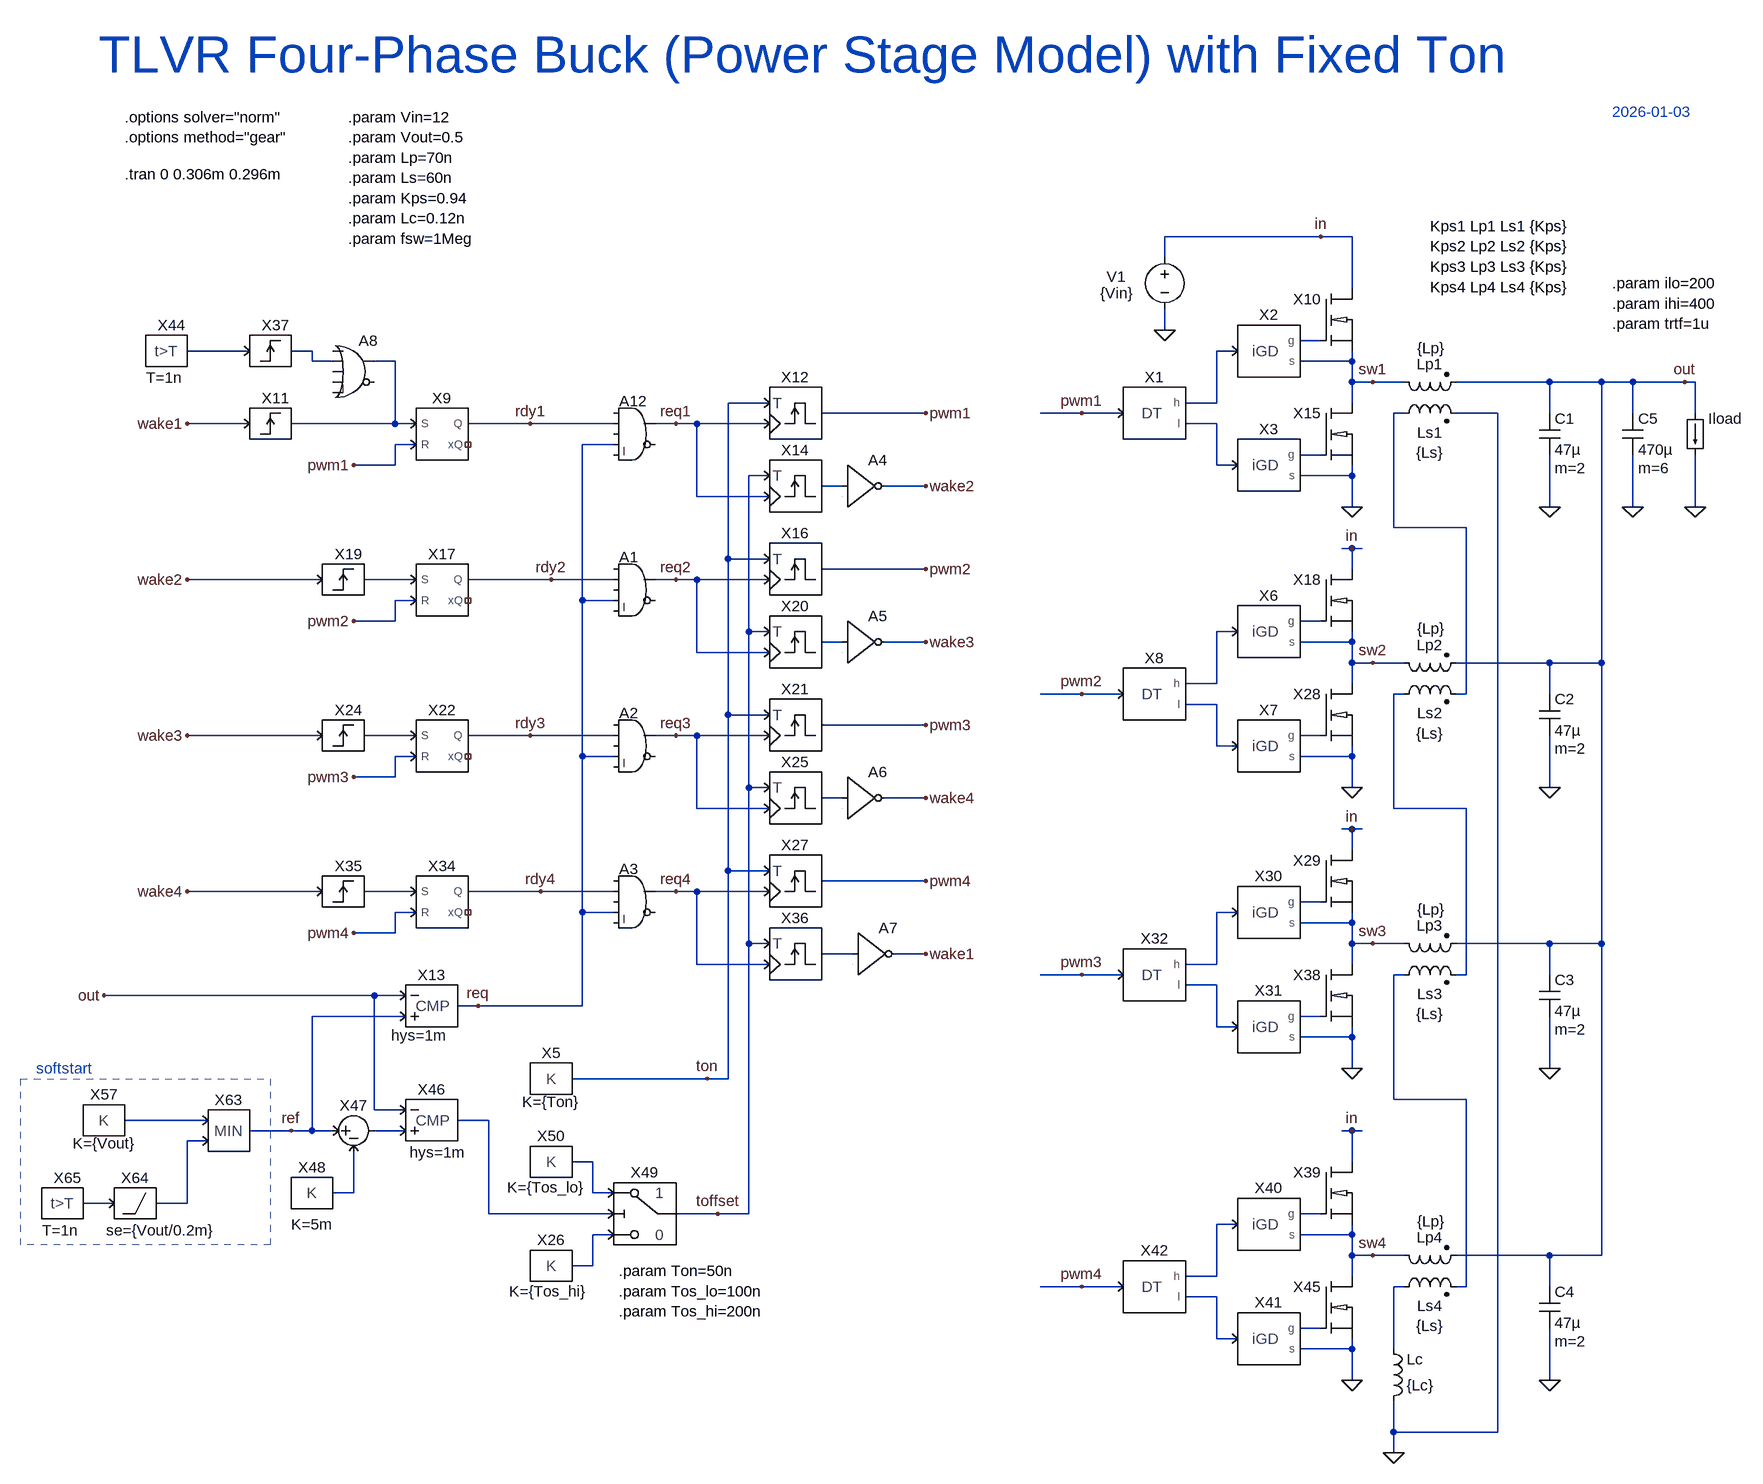
[diagram p0: schematic TLVR_4phBUCK_powerstage.asc]
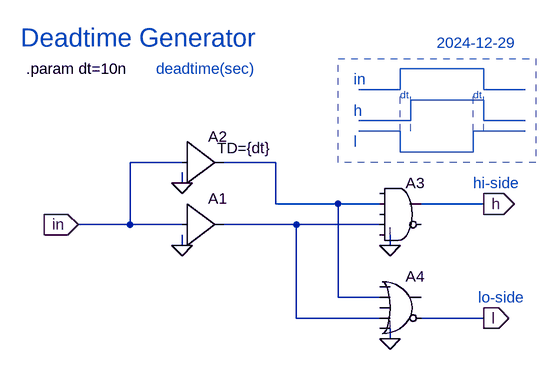
[diagram p1: sub-circuit deadtime.asc]
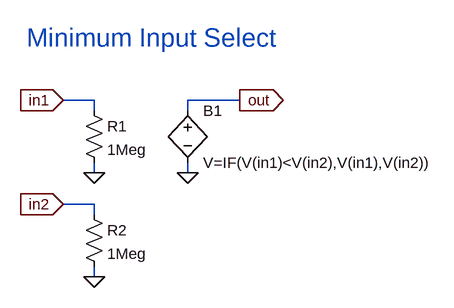
[diagram p2: sub-circuit min.asc]
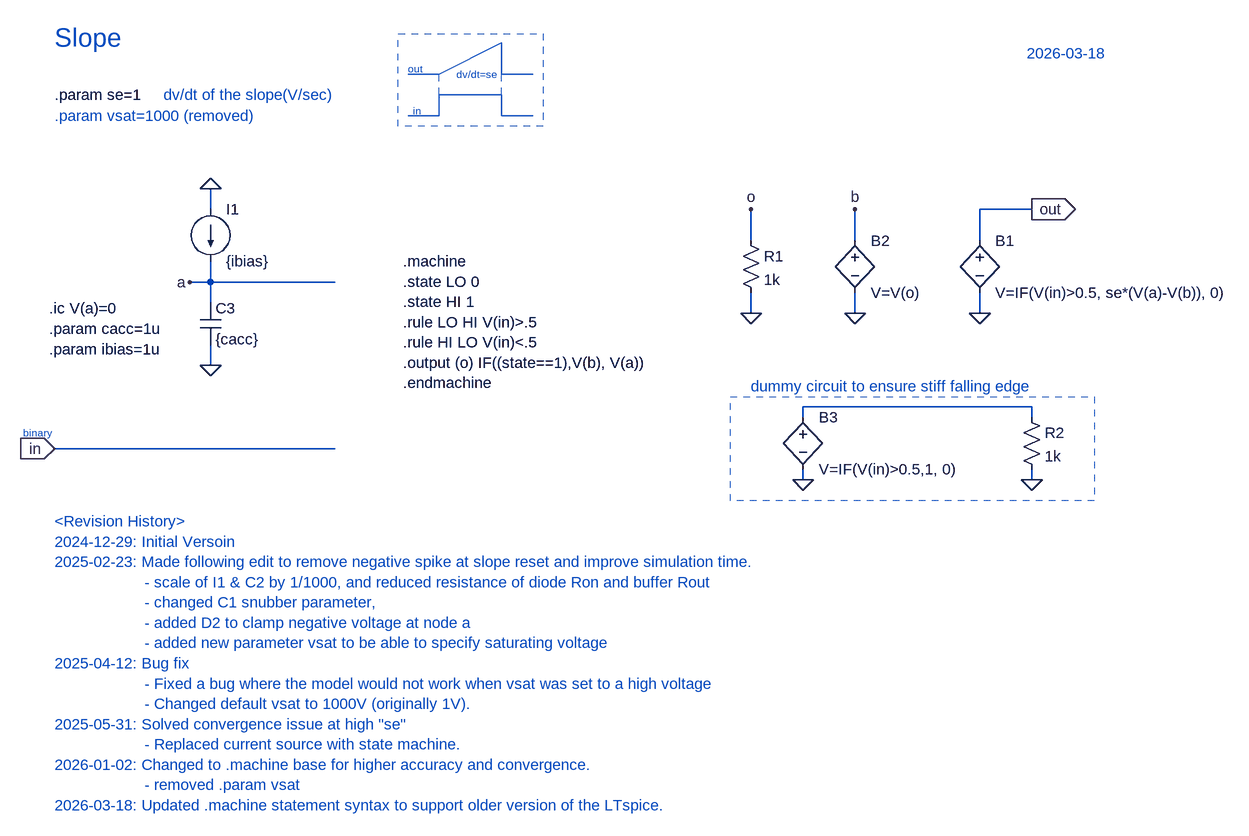
[diagram p3: sub-circuit slope.asc]
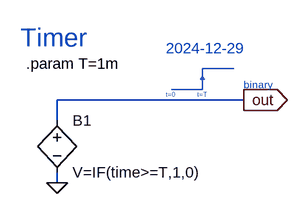
[diagram p4: sub-circuit timer.asc]
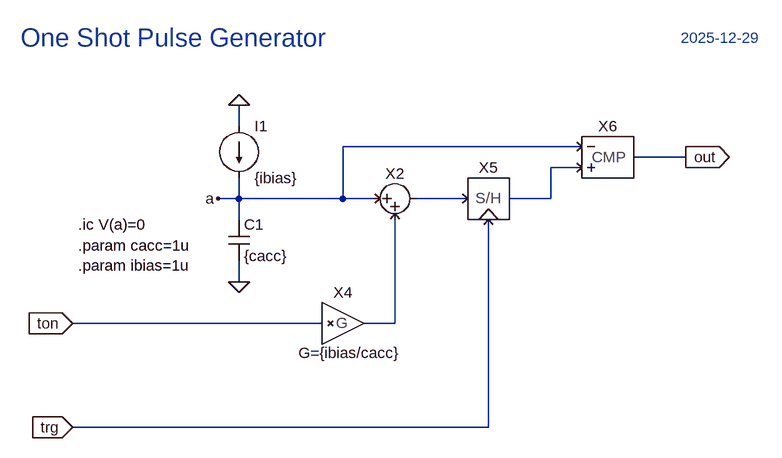
[diagram p5: sub-circuit oneshot.asc]
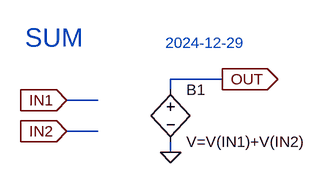
[diagram p6: sub-circuit sum.asc]
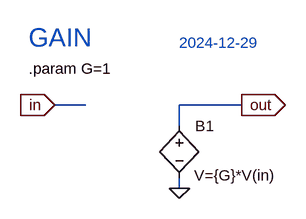
[diagram p7: sub-circuit gain.asc]
TLVR_4phBUCK_powerstage.asc, the LTspice schematic file:
Version 4.1
SHEET 1 3372 4420
WIRE 1088 320 848 320
WIRE 1136 320 1088 320
WIRE 848 352 848 320
WIRE 1136 400 1136 320
WIRE 848 464 848 432
WIRE 1088 480 1056 480
WIRE -560 496 -656 496
WIRE -464 496 -496 496
WIRE 960 496 928 496
WIRE -464 512 -464 496
WIRE -432 512 -464 512
WIRE -336 512 -368 512
WIRE 1136 512 1136 496
WIRE 1136 512 1056 512
WIRE 1136 544 1136 512
WIRE 1168 544 1136 544
WIRE 1216 544 1168 544
WIRE 1440 544 1296 544
WIRE 1520 544 1440 544
WIRE 1568 544 1520 544
WIRE 1648 544 1568 544
WIRE 1664 544 1648 544
WIRE 240 576 176 576
WIRE 928 576 928 496
WIRE 928 576 880 576
WIRE 1136 576 1136 544
WIRE 480 592 320 592
WIRE 720 592 656 592
WIRE 784 592 720 592
WIRE 1216 592 1200 592
WIRE 1360 592 1296 592
WIRE 1440 592 1440 544
WIRE 1568 592 1568 544
WIRE 1664 592 1664 544
WIRE -560 608 -656 608
WIRE -336 608 -336 512
WIRE -336 608 -496 608
WIRE -304 608 -336 608
WIRE -128 608 -224 608
WIRE 0 608 -128 608
WIRE 96 608 64 608
WIRE 128 608 96 608
WIRE 240 608 128 608
WIRE 928 608 880 608
WIRE -304 640 -336 640
WIRE 0 640 -48 640
WIRE 1088 656 1056 656
WIRE -336 672 -336 640
WIRE -336 672 -400 672
WIRE 928 672 928 608
WIRE 960 672 928 672
WIRE 240 688 208 688
WIRE 1136 688 1136 672
WIRE 1136 688 1056 688
WIRE 352 704 320 704
WIRE 480 704 416 704
WIRE 128 720 128 608
WIRE 240 720 128 720
WIRE 1136 736 1136 688
WIRE 1440 736 1440 656
WIRE 1568 736 1568 656
WIRE 1664 736 1664 656
WIRE 1200 768 1200 592
WIRE 1312 768 1200 768
WIRE 1136 800 1120 800
WIRE 1152 800 1136 800
WIRE 176 816 176 576
WIRE 240 816 176 816
WIRE 480 832 320 832
WIRE 1136 832 1136 800
WIRE -448 848 -656 848
WIRE -304 848 -384 848
WIRE -96 848 -224 848
WIRE 0 848 -96 848
WIRE 96 848 64 848
WIRE 128 848 96 848
WIRE 240 848 128 848
WIRE -304 880 -336 880
WIRE -48 880 -48 640
WIRE 0 880 -48 880
WIRE -336 912 -336 880
WIRE -336 912 -400 912
WIRE 1088 912 1056 912
WIRE 208 928 208 688
WIRE 240 928 208 928
WIRE 960 928 928 928
WIRE 352 944 320 944
WIRE 480 944 416 944
WIRE 1136 944 1136 928
WIRE 1136 944 1056 944
WIRE 128 960 128 848
WIRE 240 960 128 960
WIRE 1136 976 1136 944
WIRE 1168 976 1136 976
WIRE 1216 976 1168 976
WIRE 1440 976 1296 976
WIRE 1520 976 1520 544
WIRE 1520 976 1440 976
WIRE 928 1008 928 928
WIRE 928 1008 880 1008
WIRE 1136 1008 1136 976
WIRE 720 1024 656 1024
WIRE 784 1024 720 1024
WIRE 1216 1024 1200 1024
WIRE 1312 1024 1312 768
WIRE 1312 1024 1296 1024
WIRE 1440 1024 1440 976
WIRE 928 1040 880 1040
WIRE 176 1056 176 816
WIRE 240 1056 176 1056
WIRE 480 1072 320 1072
WIRE -448 1088 -656 1088
WIRE -304 1088 -384 1088
WIRE -128 1088 -224 1088
WIRE 0 1088 -128 1088
WIRE 96 1088 64 1088
WIRE 128 1088 96 1088
WIRE 240 1088 128 1088
WIRE 1088 1088 1056 1088
WIRE 928 1104 928 1040
WIRE 960 1104 928 1104
WIRE -304 1120 -336 1120
WIRE -48 1120 -48 880
WIRE 0 1120 -48 1120
WIRE 1136 1120 1136 1104
WIRE 1136 1120 1056 1120
WIRE -336 1152 -336 1120
WIRE -336 1152 -400 1152
WIRE 208 1168 208 928
WIRE 240 1168 208 1168
WIRE 1136 1168 1136 1120
WIRE 1440 1168 1440 1088
WIRE 352 1184 320 1184
WIRE 480 1184 416 1184
WIRE 128 1200 128 1088
WIRE 240 1200 128 1200
WIRE 1200 1200 1200 1024
WIRE 1312 1200 1200 1200
WIRE 1136 1232 1120 1232
WIRE 1152 1232 1136 1232
WIRE 1136 1264 1136 1232
WIRE 176 1296 176 1056
WIRE 240 1296 176 1296
WIRE 480 1312 320 1312
WIRE -448 1328 -656 1328
WIRE -304 1328 -384 1328
WIRE -112 1328 -224 1328
WIRE 0 1328 -112 1328
WIRE 96 1328 64 1328
WIRE 128 1328 96 1328
WIRE 240 1328 128 1328
WIRE 1088 1344 1056 1344
WIRE -304 1360 -336 1360
WIRE -48 1360 -48 1120
WIRE 0 1360 -48 1360
WIRE 960 1360 928 1360
WIRE 1136 1376 1136 1360
WIRE 1136 1376 1056 1376
WIRE -336 1392 -336 1360
WIRE -336 1392 -400 1392
WIRE 208 1408 208 1168
WIRE 240 1408 208 1408
WIRE 1136 1408 1136 1376
WIRE 1168 1408 1136 1408
WIRE 1216 1408 1168 1408
WIRE 1440 1408 1296 1408
WIRE 1520 1408 1520 976
WIRE 1520 1408 1440 1408
WIRE 368 1424 320 1424
WIRE 480 1424 432 1424
WIRE 128 1440 128 1328
WIRE 240 1440 128 1440
WIRE 928 1440 928 1360
WIRE 928 1440 880 1440
WIRE 1136 1440 1136 1408
WIRE 720 1456 656 1456
WIRE 784 1456 720 1456
WIRE 1216 1456 1200 1456
WIRE 1312 1456 1312 1200
WIRE 1312 1456 1296 1456
WIRE 1440 1456 1440 1408
WIRE 928 1472 880 1472
WIRE -368 1488 -784 1488
WIRE -320 1488 -368 1488
WIRE -208 1504 -240 1504
WIRE -48 1504 -48 1360
WIRE -48 1504 -208 1504
WIRE -320 1520 -464 1520
WIRE 1088 1520 1056 1520
WIRE 928 1536 928 1472
WIRE 960 1536 928 1536
WIRE 1136 1552 1136 1536
WIRE 1136 1552 1056 1552
WIRE 1136 1600 1136 1552
WIRE 1440 1600 1440 1520
WIRE 144 1616 -64 1616
WIRE 176 1616 176 1296
WIRE 176 1616 144 1616
WIRE 1200 1648 1200 1456
WIRE 1312 1648 1200 1648
WIRE -368 1664 -368 1488
WIRE -320 1664 -368 1664
WIRE -624 1680 -752 1680
WIRE -192 1680 -240 1680
WIRE -496 1696 -560 1696
WIRE -464 1696 -464 1520
WIRE -464 1696 -496 1696
WIRE -432 1696 -464 1696
WIRE -320 1696 -368 1696
WIRE 1136 1696 1120 1696
WIRE 1152 1696 1136 1696
WIRE -624 1712 -656 1712
WIRE -32 1744 -64 1744
WIRE 1136 1744 1136 1696
WIRE -400 1792 -400 1728
WIRE -400 1792 -432 1792
WIRE -32 1792 -32 1744
WIRE 0 1792 -32 1792
WIRE -768 1808 -816 1808
WIRE -656 1808 -656 1712
WIRE -656 1808 -704 1808
WIRE -192 1824 -192 1680
WIRE 0 1824 -192 1824
WIRE 160 1824 96 1824
WIRE 208 1824 208 1408
WIRE 208 1824 160 1824
WIRE 1088 1824 1056 1824
WIRE 960 1840 928 1840
WIRE 0 1856 -32 1856
WIRE 1136 1856 1136 1840
WIRE 1136 1856 1056 1856
WIRE 1136 1888 1136 1856
WIRE 1168 1888 1136 1888
WIRE 1216 1888 1168 1888
WIRE 1440 1888 1296 1888
WIRE 1520 1888 1520 1408
WIRE 1520 1888 1440 1888
WIRE -32 1904 -32 1856
WIRE -32 1904 -64 1904
WIRE 928 1920 928 1840
WIRE 928 1920 880 1920
WIRE 1136 1920 1136 1888
WIRE 720 1936 656 1936
WIRE 784 1936 720 1936
WIRE 1216 1936 1200 1936
WIRE 1312 1936 1312 1648
WIRE 1312 1936 1296 1936
WIRE 1440 1936 1440 1888
WIRE 928 1952 880 1952
WIRE 1088 2000 1056 2000
WIRE 928 2016 928 1952
WIRE 960 2016 928 2016
WIRE 1136 2032 1136 2016
WIRE 1136 2032 1056 2032
WIRE 1200 2032 1200 1936
WIRE 1136 2080 1136 2032
WIRE 1440 2080 1440 2000
WIRE 1200 2160 1200 2112
WIRE 1360 2160 1360 592
WIRE 1360 2160 1200 2160
WIRE 1200 2192 1200 2160
FLAG 1136 736 0
FLAG 848 464 0
FLAG 1440 736 0
FLAG 1648 544 out
FLAG 1088 320 in
FLAG 1168 544 sw1
FLAG 1664 736 0
FLAG 720 592 pwm1
FLAG 1136 1168 0
FLAG 1440 1168 0
FLAG 1136 800 in
FLAG 1168 976 sw2
FLAG 720 1024 pwm2
FLAG 1136 1600 0
FLAG 1440 1600 0
FLAG 1136 1232 in
FLAG 1168 1408 sw3
FLAG 720 1456 pwm3
FLAG 1136 2080 0
FLAG 1440 2080 0
FLAG 1136 1696 in
FLAG 1168 1888 sw4
FLAG 720 1936 pwm4
FLAG 1200 2192 0
FLAG -784 1488 out
FLAG -496 1696 ref
FLAG 480 592 pwm1
FLAG 96 608 req1
FLAG -208 1504 req
FLAG -128 608 rdy1
FLAG -400 672 pwm1
FLAG 160 1824 toffset
FLAG 480 704 wake2
FLAG 480 832 pwm2
FLAG 96 848 req2
FLAG -96 848 rdy2
FLAG -400 912 pwm2
FLAG 480 944 wake3
FLAG 480 1072 pwm3
FLAG 96 1088 req3
FLAG -128 1088 rdy3
FLAG 480 1184 wake4
FLAG 480 1312 pwm4
FLAG 96 1328 req4
FLAG -112 1328 rdy4
FLAG -400 1392 pwm4
FLAG 480 1424 wake1
FLAG -400 1152 pwm3
FLAG -656 608 wake1
FLAG -656 848 wake2
FLAG -656 1088 wake3
FLAG -656 1328 wake4
FLAG 144 1616 ton
FLAG 1568 736 0
SYMBOL voltage 848 336 R0
WINDOW 0 -75 30 Top 2
WINDOW 3 -74 87 Bottom 2
WINDOW 123 0 0 Left 0
WINDOW 39 0 0 Left 0
SYMATTR InstName V1
SYMATTR Value {Vin}
SYMBOL cap 1424 592 R0
WINDOW 123 24 84 Left 2
SYMATTR Value2 m=2
SYMATTR InstName C1
SYMATTR Value 47µ
SYMATTR SpiceLine Rser=0.1m
SYMBOL iGD 1008 496 R0
SYMATTR InstName X2
SYMBOL iGD 1008 672 R0
SYMATTR InstName X3
SYMBOL DEADTIME 832 592 R0
SYMATTR InstName X1
SYMBOL iNMOS 1136 448 R0
SYMATTR SpiceLine ron=0.1m
SYMATTR InstName X10
SYMBOL iGD 1008 928 R0
SYMATTR InstName X6
SYMBOL iGD 1008 1104 R0
SYMATTR InstName X7
SYMBOL DEADTIME 832 1024 R0
SYMATTR InstName X8
SYMBOL iGD 1008 1360 R0
SYMATTR InstName X30
SYMBOL iGD 1008 1536 R0
SYMATTR InstName X31
SYMBOL DEADTIME 832 1456 R0
SYMATTR InstName X32
SYMBOL iGD 1008 1840 R0
SYMATTR InstName X40
SYMBOL iGD 1008 2016 R0
SYMATTR InstName X41
SYMBOL DEADTIME 832 1936 R0
SYMATTR InstName X42
SYMBOL ind2 1200 528 M90
WINDOW 0 4 56 VBottom 2
WINDOW 3 -52 58 VTop 2
SYMATTR InstName Lp1
SYMATTR Value {Lp}
SYMATTR SpiceLine Rser=0.125m
SYMBOL ind2 1200 608 R270
WINDOW 0 -29 56 VTop 2
WINDOW 3 -29 56 VBottom 2
SYMATTR InstName Ls1
SYMATTR Value {Ls}
SYMATTR SpiceLine Rser=0.45m
SYMBOL ind2 1200 960 M90
WINDOW 0 4 56 VBottom 2
WINDOW 3 -52 58 VTop 2
SYMATTR InstName Lp2
SYMATTR Value {Lp}
SYMATTR SpiceLine Rser=0.125m
SYMBOL ind2 1200 1040 R270
WINDOW 0 -29 56 VTop 2
WINDOW 3 -29 56 VBottom 2
SYMATTR InstName Ls2
SYMATTR Value {Ls}
SYMATTR SpiceLine Rser=0.45m
SYMBOL ind2 1200 1392 M90
WINDOW 0 4 56 VBottom 2
WINDOW 3 -52 58 VTop 2
SYMATTR InstName Lp3
SYMATTR Value {Lp}
SYMATTR SpiceLine Rser=0.125m
SYMBOL ind2 1200 1472 R270
WINDOW 0 -29 56 VTop 2
WINDOW 3 -29 56 VBottom 2
SYMATTR InstName Ls3
SYMATTR Value {Ls}
SYMATTR SpiceLine Rser=0.45m
SYMBOL ind2 1200 1872 M90
WINDOW 0 4 56 VBottom 2
WINDOW 3 -52 58 VTop 2
SYMATTR InstName Lp4
SYMATTR Value {Lp}
SYMATTR SpiceLine Rser=0.125m
SYMBOL ind2 1200 1952 R270
WINDOW 0 -29 56 VTop 2
WINDOW 3 -29 56 VBottom 2
SYMATTR InstName Ls4
SYMATTR Value {Ls}
SYMATTR SpiceLine Rser=0.45m
SYMBOL ind 1184 2128 M180
WINDOW 0 36 80 Left 2
WINDOW 3 36 40 Left 2
SYMATTR InstName Lc
SYMATTR Value {Lc}
SYMATTR SpiceLine Rser=2m
SYMBOL cap 1424 1024 R0
WINDOW 123 24 84 Left 2
SYMATTR Value2 m=2
SYMATTR InstName C2
SYMATTR Value 47µ
SYMATTR SpiceLine Rser=0.1m
SYMBOL cap 1424 1456 R0
WINDOW 123 24 84 Left 2
SYMATTR Value2 m=2
SYMATTR InstName C3
SYMATTR Value 47µ
SYMATTR SpiceLine Rser=0.1m
SYMBOL cap 1424 1936 R0
WINDOW 123 24 84 Left 2
SYMATTR Value2 m=2
SYMATTR InstName C4
SYMATTR Value 47µ
SYMATTR SpiceLine Rser=0.1m
SYMBOL CONST -784 1680 R0
WINDOW 39 0 51 Bottom 2
SYMATTR SpiceLine K={Vout}
SYMATTR InstName X57
SYMBOL PowerSim\\MIN -592 1696 R0
SYMATTR InstName X63
SYMBOL PowerSim\\SLOPE -736 1808 R0
WINDOW 39 39 57 Bottom 2
SYMATTR SpiceLine se={Vout/0.2m}
SYMATTR InstName X64
SYMBOL PowerSim\\TIMER -848 1808 R0
WINDOW 39 -3 57 Bottom 2
SYMATTR SpiceLine T=1n
SYMATTR InstName X65
SYMBOL PowerSim\\ONESHOT 288 592 R0
SYMATTR InstName X12
SYMBOL PowerSim\\CMP -272 1504 R0
WINDOW 39 -27 61 Bottom 2
SYMATTR SpiceLine hys=1m
SYMATTR InstName X13
SYMBOL Digital\\and 32 560 R0
WINDOW 0 -23 13 Left 2
SYMATTR InstName A12
SYMBOL PowerSim\\SRFF -272 624 R0
SYMATTR InstName X9
SYMBOL PowerSim\\POSEDGE -528 608 R0
SYMATTR InstName X11
SYMBOL PowerSim\\ONESHOT 288 704 R0
SYMATTR InstName X14
SYMBOL PowerSim\\ONESHOT 288 832 R0
SYMATTR InstName X16
SYMBOL Digital\\and 32 800 R0
WINDOW 0 -23 13 Left 2
SYMATTR InstName A1
SYMBOL PowerSim\\SRFF -272 864 R0
SYMATTR InstName X17
SYMBOL PowerSim\\POSEDGE -416 848 R0
SYMATTR InstName X19
SYMBOL PowerSim\\ONESHOT 288 944 R0
SYMATTR InstName X20
SYMBOL PowerSim\\ONESHOT 288 1072 R0
SYMATTR InstName X21
SYMBOL Digital\\and 32 1040 R0
WINDOW 0 -23 13 Left 2
SYMATTR InstName A2
SYMBOL PowerSim\\SRFF -272 1104 R0
SYMATTR InstName X22
SYMBOL PowerSim\\POSEDGE -416 1088 R0
SYMATTR InstName X24
SYMBOL PowerSim\\ONESHOT 288 1184 R0
SYMATTR InstName X25
SYMBOL CONST -96 1904 R0
WINDOW 39 -5 55 Bottom 2
SYMATTR SpiceLine K={Tos_hi}
SYMATTR InstName X26
SYMBOL PowerSim\\ONESHOT 288 1312 R0
SYMATTR InstName X27
SYMBOL Digital\\and 32 1280 R0
WINDOW 0 -23 13 Left 2
SYMATTR InstName A3
SYMBOL PowerSim\\SRFF -272 1344 R0
SYMATTR InstName X34
SYMBOL PowerSim\\POSEDGE -416 1328 R0
SYMATTR InstName X35
SYMBOL PowerSim\\ONESHOT 288 1424 R0
SYMATTR InstName X36
SYMBOL Digital\\inv 352 640 R0
SYMATTR InstName A4
SYMBOL Digital\\inv 352 880 R0
SYMATTR InstName A5
SYMBOL Digital\\inv 352 1120 R0
SYMATTR InstName A6
SYMBOL Digital\\inv 368 1360 R0
SYMATTR InstName A7
SYMBOL PowerSim\\POSEDGE -528 496 R0
SYMATTR InstName X37
SYMBOL Digital\\or -400 464 R0
SYMATTR InstName A8
SYMBOL PowerSim\\TIMER -688 496 R0
WINDOW 39 -3 57 Bottom 2
SYMATTR SpiceLine T=1n
SYMATTR InstName X44
SYMBOL CONST -96 1616 R0
WINDOW 39 0 51 Bottom 2
SYMATTR SpiceLine K={Ton}
SYMATTR InstName X5
SYMBOL iNMOS 1136 624 R0
SYMATTR SpiceLine ron=0.1m
SYMATTR InstName X15
SYMBOL iNMOS 1136 880 R0
SYMATTR SpiceLine ron=0.1m
SYMATTR InstName X18
SYMBOL iNMOS 1136 1056 R0
SYMATTR SpiceLine ron=0.1m
SYMATTR InstName X28
SYMBOL iNMOS 1136 1312 R0
SYMATTR SpiceLine ron=0.1m
SYMATTR InstName X29
SYMBOL iNMOS 1136 1488 R0
SYMATTR SpiceLine ron=0.1m
SYMATTR InstName X38
SYMBOL iNMOS 1136 1792 R0
SYMATTR SpiceLine ron=0.1m
SYMATTR InstName X39
SYMBOL iNMOS 1136 1968 R0
SYMATTR SpiceLine ron=0.1m
SYMATTR InstName X45
SYMBOL PowerSim\\CMP -272 1680 R0
WINDOW 39 1 65 Bottom 2
SYMATTR SpiceLine hys=1m
SYMATTR InstName X46
SYMBOL PowerSim\\SUB -400 1696 R0
SYMATTR InstName X47
SYMBOL PowerSim\\CONST -464 1792 R0
WINDOW 39 0 64 Bottom 2
SYMATTR SpiceLine K=5m
SYMATTR InstName X48
SYMBOL PowerSim\\MUX 48 1824 R0
SYMATTR InstName X49
SYMBOL CONST -96 1744 R0
WINDOW 39 -8 55 Bottom 2
SYMATTR SpiceLine K={Tos_lo}
SYMATTR InstName X50
SYMBOL load 1648 592 R0
WINDOW 3 48 56 Invisible 2
WINDOW 123 0 0 Left 0
WINDOW 39 48 36 Left 2
SYMATTR Value PWL(0 {ilo} 0.3m {ilo} +{trtf} {ihi} 0.6m {ihi} +{trtf} {ilo})
SYMATTR InstName Iload
SYMBOL cap 1552 592 R0
WINDOW 123 24 84 Left 2
SYMATTR Value2 m=6
SYMATTR InstName C5
SYMATTR Value 470µ
SYMATTR SpiceLine Rser=2m
TEXT -752 224 Left 2 !.tran 0 0.306m 0.296m
TEXT -792 40 Left 6 ;TLVR Four-Phase Buck (Power Stage Model) with Fixed Ton
TEXT 1536 128 Left 2 ;2026-01-03
TEXT -408 136 Left 2 !.param Vin=12\n.param Vout=0.5\n.param Lp=70n\n.param Ls=60n\n.param Kps=0.94\n.param Lc=0.12n\n.param fsw=1Meg
TEXT 1536 392 Left 2 !.param ilo=200\n.param ihi=400\n.param trtf=1u
TEXT -752 136 Left 2 !.options solver="norm"\n.options method="gear"
TEXT 1256 304 Left 2 !Kps1 Lp1 Ls1 {Kps}\nKps2 Lp2 Ls2 {Kps}\nKps3 Lp3 Ls3 {Kps}\nKps4 Lp4 Ls4 {Kps}
TEXT -888 1600 Left 2 ;softstart
TEXT 8 1912 Left 2 !.param Ton=50n\n.param Tos_lo=100n\n.param Tos_hi=200n
RECTANGLE Normal -528 1872 -912 1616 2

deadtime.asc, the sub-circuit schematic file:
Version 4
SHEET 1 1412 1312
WIRE 64 288 -16 288
WIRE 208 288 128 288
WIRE 64 320 64 304
WIRE 208 352 208 288
WIRE 304 352 208 352
WIRE 368 352 304 352
WIRE 528 352 432 352
WIRE -16 384 -16 288
WIRE -16 384 -96 384
WIRE 64 384 -16 384
WIRE 240 384 128 384
WIRE 368 384 240 384
WIRE 64 416 64 400
WIRE 384 416 384 400
WIRE 304 496 304 352
WIRE 368 496 304 496
WIRE 240 528 240 384
WIRE 368 528 240 528
WIRE 528 528 432 528
WIRE 384 560 384 544
FLAG -96 384 in
IOPIN -96 384 In
FLAG 64 416 0
FLAG 64 320 0
FLAG 384 416 0
FLAG 384 560 0
FLAG 528 352 h
IOPIN 528 352 Out
FLAG 528 528 l
IOPIN 528 528 Out
SYMBOL Digital\\buf1 64 320 R0
SYMATTR InstName A1
SYMBOL Digital\\buf1 64 224 R0
WINDOW 3 54 42 Left 2
SYMATTR Value TD={dt}
SYMATTR InstName A2
SYMBOL Digital\\and 400 304 R0
SYMATTR InstName A3
SYMBOL Digital\\or 400 448 R0
SYMATTR InstName A4
TEXT -176 144 Left 2 !.param dt=10n
TEXT -184 96 Left 4 ;Deadtime Generator
TEXT 24 144 Left 2 ;deadtime(sec)
TEXT 512 320 Left 2 ;hi-side
TEXT 520 496 Left 2 ;lo-side
TEXT 328 160 Left 2 ;in
TEXT 328 208 Left 2 ;h
TEXT 328 256 Left 2 ;l
TEXT 400 184 Left 1 ;dt
TEXT 512 184 Left 1 ;dt
TEXT 456 104 Left 2 ;2024-12-29
LINE Normal 400 176 336 176
LINE Normal 400 176 400 144
LINE Normal 528 144 400 144
LINE Normal 528 176 528 144
LINE Normal 592 176 528 176
LINE Normal 416 224 336 224
LINE Normal 416 224 416 192
LINE Normal 528 192 416 192
LINE Normal 528 224 528 192
LINE Normal 592 224 528 224
LINE Normal 400 240 336 240
LINE Normal 400 272 400 240
LINE Normal 512 272 400 272
LINE Normal 512 272 512 240
LINE Normal 592 240 512 240
LINE Normal 400 240 400 176 2
LINE Normal 512 240 512 176 2
LINE Normal 416 240 416 176 2
LINE Normal 528 240 528 176 2
RECTANGLE Normal 608 288 304 128 2

min.asc, the sub-circuit schematic file:
Version 4
SHEET 1 880 680
WIRE 112 64 64 64
WIRE 336 64 256 64
WIRE 112 80 112 64
WIRE 256 80 256 64
WIRE 112 176 112 160
WIRE 256 176 256 160
WIRE 112 224 64 224
WIRE 112 240 112 224
WIRE 112 336 112 320
FLAG 64 64 in1
IOPIN 64 64 In
FLAG 64 224 in2
IOPIN 64 224 In
FLAG 256 176 0
FLAG 336 64 out
IOPIN 336 64 Out
FLAG 112 176 0
FLAG 112 336 0
SYMBOL bv 256 64 R0
SYMATTR InstName B1
SYMATTR Value V=IF(V(in1)<V(in2),V(in1),V(in2))
SYMBOL res 96 64 R0
SYMATTR InstName R1
SYMATTR Value 1Meg
SYMBOL res 96 224 R0
SYMATTR InstName R2
SYMATTR Value 1Meg
TEXT 8 -32 Left 4 ;Minimum Input Select

slope.asc, the sub-circuit schematic file:
Version 4.1
SHEET 1 2080 1228
WIRE -64 288 -64 256
WIRE 1200 288 1120 288
WIRE 768 336 768 288
WIRE 928 336 928 288
WIRE 1120 336 1120 288
WIRE -64 400 -64 368
WIRE -64 400 -96 400
WIRE 128 400 -64 400
WIRE -64 432 -64 400
WIRE 768 448 768 416
WIRE 928 448 928 416
WIRE 1120 448 1120 416
WIRE -64 528 -64 496
WIRE 1200 592 848 592
WIRE 848 608 848 592
WIRE 1200 608 1200 592
WIRE 128 656 -304 656
WIRE 848 704 848 688
WIRE 1200 704 1200 688
FLAG -304 656 in
IOPIN -304 656 In
FLAG -64 256 0
FLAG -64 528 0
FLAG 1200 288 out
IOPIN 1200 288 Out
FLAG -96 400 a
FLAG 1120 448 0
FLAG 768 448 0
FLAG 768 288 o
FLAG 928 448 0
FLAG 928 288 b
FLAG 1200 704 0
FLAG 848 704 0
SYMBOL current -64 288 R0
SYMATTR InstName I1
SYMATTR Value {ibias}
SYMBOL cap -80 432 R0
SYMATTR InstName C3
SYMATTR Value {cacc}
SYMBOL bv 1120 320 R0
SYMATTR InstName B1
SYMATTR Value V=IF(V(in)>0.5, se*(V(a)-V(b)), 0)
SYMBOL res 752 320 R0
SYMATTR InstName R1
SYMATTR Value 1k
SYMBOL bv 928 320 R0
SYMATTR InstName B2
SYMATTR Value V=V(o)
SYMBOL bv 848 592 R0
SYMATTR InstName B3
SYMATTR Value V=IF(V(in)>0.5,1, 0)
SYMBOL res 1184 592 R0
SYMATTR InstName R2
SYMATTR Value 1k
TEXT -304 112 Left 2 !.param se=1
TEXT -304 24 Left 4 ;Slope
TEXT -352 632 Left 1 ;binary
TEXT -136 112 Left 2 ;dv/dt of the slope(V/sec)
TEXT 248 136 Left 1 ;in
TEXT 240 72 Left 1 ;out
TEXT 376 80 Right 1 ;dv/dt=se
TEXT 1192 48 Left 2 ;2026-03-18
TEXT -304 768 Left 2 ;<Revision History>\n2024-12-29: Initial Versoin\n2025-02-23: Made following edit to remove negative spike at slope reset and improve simulation time.\n                    - scale of I1 & C2 by 1/1000, and reduced resistance of diode Ron and buffer Rout\n                    - changed C1 snubber parameter, \n                    - added D2 to clamp negative voltage at node a \n                    - added new parameter vsat to be able to specify saturating voltage\n2025-04-12: Bug fix \n                    - Fixed a bug where the model would not work when vsat was set to a high voltage \n                    - Changed default vsat to 1000V (originally 1V).\n2025-05-31: Solved convergence issue at high "se" \n                    - Replaced current source with state machine.\n2026-01-02: Changed to .machine base for higher accuracy and convergence.\n                    - removed .param vsat\n2026-03-18: Updated .machine statement syntax to support older version of the LTspice.
TEXT -304 144 Left 2 ;.param vsat=1000 (removed)
TEXT -312 472 Left 2 !.param cacc=1u\n.param ibias=1u
TEXT -312 440 Left 2 !.ic V(a)=0
TEXT 232 368 Left 2 !.machine\n.state LO 0\n.state HI 1\n.rule LO HI V(in)>.5\n.rule HI LO V(in)<.5\n.output (o) IF((state==1),V(b), V(a))\n.endmachine
TEXT 768 560 Left 2 ;dummy circuit to ensure stiff falling edge
LINE Normal 288 144 240 144
LINE Normal 288 144 288 112
LINE Normal 384 112 288 112
LINE Normal 384 144 384 112
LINE Normal 432 144 384 144
LINE Normal 288 80 240 80
LINE Normal 288 80 384 32
LINE Normal 384 80 384 32
LINE Normal 432 80 384 80
LINE Normal 288 112 288 80 1
LINE Normal 384 112 384 80 1
RECTANGLE Normal 448 160 225 18 2
RECTANGLE Normal 1296 736 736 576 2

timer.asc, the sub-circuit schematic file:
Version 4
SHEET 1 1328 680
WIRE 1008 -128 720 -128
WIRE 720 -96 720 -128
WIRE 720 0 720 -16
FLAG 1008 -128 out
IOPIN 1008 -128 Out
FLAG 720 0 0
SYMBOL bv 720 -112 R0
SYMATTR InstName B1
SYMATTR Value V=IF(time>=T,1,0)
TEXT 672 -184 Left 2 !.param T=1m
TEXT 664 -224 Left 4 ;Timer
TEXT 1008 -152 Left 1 ;binary
TEXT 888 -136 Left 0 ;t=0
TEXT 936 -136 Left 0 ;t=T
TEXT 888 -208 Left 2 ;2024-12-29
LINE Normal 944 -144 896 -144
LINE Normal 944 -176 944 -144
LINE Normal 992 -176 944 -176
LINE Normal 947 -159 944 -163
LINE Normal 941 -159 944 -163

oneshot.asc, the sub-circuit schematic file:
Version 4.1
SHEET 1 1156 848
WIRE 336 224 336 192
WIRE 864 256 496 256
WIRE 1024 272 944 272
WIRE 864 288 816 288
WIRE 336 336 336 304
WIRE 336 336 304 336
WIRE 496 336 496 256
WIRE 496 336 336 336
WIRE 544 336 496 336
WIRE 688 336 608 336
WIRE 816 336 816 288
WIRE 816 336 752 336
WIRE 336 368 336 336
WIRE 336 464 336 432
WIRE 464 528 80 528
WIRE 576 528 576 368
WIRE 576 528 528 528
WIRE 720 688 720 368
WIRE 720 688 80 688
FLAG 336 192 0
FLAG 336 464 0
FLAG 1024 272 out
IOPIN 1024 272 Out
FLAG 304 336 a
FLAG 80 528 ton
IOPIN 80 528 In
FLAG 80 688 trg
IOPIN 80 688 In
SYMBOL current 336 224 R0
SYMATTR InstName I1
SYMATTR Value {ibias}
SYMBOL cap 320 368 R0
SYMATTR InstName C1
SYMATTR Value {cacc}
SYMBOL PowerSim\\SUM 576 336 R0
SYMATTR InstName X2
SYMBOL PowerSim\\GAIN 496 528 R0
WINDOW 39 9 61 Bottom 2
SYMATTR SpiceLine G={ibias/cacc}
SYMATTR InstName X4
SYMBOL PowerSim\\SAMPLEHOLD 720 336 R0
SYMATTR InstName X5
SYMBOL PowerSim\\CMP 912 272 R0
SYMATTR InstName X6
TEXT 0 88 Left 4 ;One Shot Pulse Generator
TEXT 88 408 Left 2 !.param cacc=1u\n.param ibias=1u
TEXT 88 376 Left 2 !.ic V(a)=0
TEXT 1016 88 Left 2 ;2025-12-29

sum.asc, the sub-circuit schematic file:
Version 4
SHEET 1 880 680
WIRE 288 96 208 96
WIRE 208 112 208 96
WIRE 96 128 48 128
WIRE 96 176 48 176
WIRE 208 208 208 192
FLAG 48 128 IN1
IOPIN 48 128 In
FLAG 48 176 IN2
IOPIN 48 176 In
FLAG 208 208 0
FLAG 288 96 OUT
IOPIN 288 96 Out
SYMBOL bv 208 96 R0
SYMATTR InstName B1
SYMATTR Value V=V(IN1)+V(IN2)
TEXT -16 32 Left 4 ;SUM
TEXT 200 40 Left 2 ;2024-12-29

gain.asc, the sub-circuit schematic file:
Version 4
SHEET 1 880 680
WIRE 0 64 -48 64
WIRE 240 64 144 64
WIRE 144 96 144 64
WIRE 144 192 144 176
FLAG 144 192 0
FLAG 240 64 out
IOPIN 240 64 Out
FLAG -48 64 in
IOPIN -48 64 In
SYMBOL bv 144 80 R0
WINDOW 3 23 92 Left 2
SYMATTR Value V={G}*V(in)
SYMATTR InstName B1
TEXT -88 8 Left 2 !.param G=1
TEXT -88 -40 Left 4 ;GAIN
TEXT 144 -32 Left 2 ;2024-12-29

samplehold.asc, the sub-circuit schematic file:
Version 4
SHEET 1 880 680
WIRE 576 -560 480 -560
WIRE -80 -512 -128 -512
WIRE 480 -512 480 -560
WIRE 368 -496 368 -528
WIRE -80 -448 -128 -448
WIRE 368 -400 368 -416
WIRE 480 -400 480 -432
FLAG -128 -512 IN
IOPIN -128 -512 In
FLAG -128 -448 CLK
IOPIN -128 -448 In
FLAG 576 -560 OUT
IOPIN 576 -560 Out
FLAG 368 -400 0
FLAG 368 -528 o
FLAG 480 -400 0
SYMBOL res 352 -512 R0
SYMATTR InstName R1
SYMATTR Value 1k
SYMBOL bv 480 -528 R0
SYMATTR InstName B1
SYMATTR Value V=V(o)
TEXT -248 -672 Left 3 ;Sample & Hold
TEXT -248 -448 Left 1 ;binary
TEXT 496 -656 Left 2 ;2025-3-23
TEXT -24 -544 Left 2 !.machine\n.state LO 0\n.state LATCH 1\n.state HI 2\n.rule LO LATCH V(clk)>.5\n.rule LATCH HI  V(clk)>.9\n.rule * LO V(clk)<.5\n.output (o) IF((state==1),V(in),V(out))  \n.endmachine

cmp.asc, the sub-circuit schematic file:
Version 4
SHEET 1 1276 680
WIRE 352 96 304 96
WIRE 1088 128 1024 128
WIRE 832 144 816 144
WIRE 864 144 832 144
WIRE 960 144 864 144
WIRE 864 160 864 144
WIRE 352 192 304 192
WIRE 960 192 960 176
WIRE 864 256 864 240
FLAG 304 96 inp
IOPIN 304 96 In
FLAG 304 192 inn
IOPIN 304 192 In
FLAG 1088 128 out
IOPIN 1088 128 Out
FLAG 864 256 0
FLAG 832 144 a
FLAG 960 192 0
SYMBOL res 848 144 R0
SYMATTR InstName R1
SYMATTR Value 1k
SYMBOL Digital\\buf 960 80 R0
SYMATTR InstName A1
TEXT 376 96 Left 2 !.machine\n.state LO 0\n.state HI 1\n.rule LO HI V(inp)>(V(inn)+{hys})\n.rule HI LO V(inp)<(V(inn)-{hys})\n.output (a) state\n.endmachine
TEXT 272 -24 Left 2 !.param hys=0
TEXT 256 -80 Left 4 ;Comparator
TEXT 488 -24 Left 2 ;hysteresis voltage
TEXT 768 -56 Left 2 ;2024-12-29
RECTANGLE Normal 816 288 352 48 2

srff.asc, the sub-circuit schematic file:
Version 4.1
SHEET 1 928 680
WIRE -272 -496 -304 -496
WIRE -48 -496 -272 -496
WIRE 64 -496 16 -496
WIRE 480 -496 448 -496
WIRE 544 -496 480 -496
WIRE 592 -496 544 -496
WIRE 672 -496 656 -496
WIRE -48 -464 -80 -464
WIRE 480 -464 480 -496
WIRE 592 -464 592 -480
WIRE -272 -432 -272 -496
WIRE -240 -432 -272 -432
WIRE -160 -432 -176 -432
WIRE -32 -432 -32 -448
WIRE -240 -400 -240 -416
WIRE 480 -368 480 -384
WIRE 544 -368 544 -496
WIRE 592 -368 544 -368
WIRE 672 -368 656 -368
WIRE 592 -336 592 -352
WIRE -272 -272 -304 -272
WIRE -240 -272 -272 -272
WIRE -80 -272 -80 -464
WIRE -80 -272 -176 -272
WIRE -240 -240 -240 -256
WIRE 224 -176 224 -192
WIRE -160 -160 -160 -432
WIRE -48 -160 -160 -160
WIRE 64 -160 16 -160
WIRE -272 -128 -272 -272
WIRE -48 -128 -272 -128
WIRE -32 -96 -32 -112
WIRE 224 -80 224 -96
FLAG -304 -496 S
IOPIN -304 -496 In
FLAG -304 -272 R
IOPIN -304 -272 In
FLAG -240 -240 0
FLAG -32 -432 0
FLAG 64 -496 Sa
FLAG 592 -336 0
FLAG 672 -496 Q
IOPIN 672 -496 Out
FLAG 672 -368 xQ
IOPIN 672 -368 Out
FLAG 592 -464 0
FLAG 448 -496 Qa
FLAG 480 -368 0
FLAG 224 -80 0
FLAG 224 -192 Reff
FLAG -240 -400 0
FLAG -32 -96 0
FLAG 64 -160 R_
SYMBOL Digital\\inv -240 -336 R0
SYMATTR InstName A1
SYMBOL Digital\\and -16 -544 R0
SYMATTR InstName A2
SYMBOL Digital\\inv 592 -432 R0
SYMATTR InstName A3
SYMBOL Digital\\buf1 592 -560 R0
SYMATTR InstName A4
SYMBOL res 464 -480 R0
SYMATTR InstName R1
SYMATTR Value 1k
SYMBOL bv 224 -192 R0
SYMATTR InstName B1
SYMATTR Value V=IF({prio}==0,V(R),V(R_))
SYMBOL Digital\\inv -240 -496 R0
SYMATTR InstName A5
SYMBOL Digital\\and -16 -208 R0
SYMATTR InstName A6
TEXT 112 -544 Left 2 !.machine\n.state LO 0\n.state HI1 1\n.state HI2 1\n.rule LO HI1 V(Sa)>0.5\n.rule HI1 HI2 V(Sa)<0.5\n.rule HI2 LO V(Reff)>0.5\n.output (Qa) state\n.endmachine
TEXT -352 -656 Left 3 ;SR Flip-Flop
TEXT -344 -520 Left 1 ;binary
TEXT -344 -296 Left 1 ;binary
TEXT 664 -520 Left 1 ;binary
TEXT 672 -392 Left 1 ;binary
TEXT 592 -624 Left 2 ;2025-12-29
TEXT -368 -616 Left 2 !.param prio=0
TEXT -160 -616 Left 2 ;0: priority on R (default), 1: priority on S
TEXT -344 -32 Left 2 ;<Revision History>\n2024-12-29: Initial version\n2025-12-29: Added parameter "prio" to specify priority between R and S. No impact on default behaviour.
RECTANGLE Normal 412 -294 96 -576 2

posedge.asc, the sub-circuit schematic file:
Version 4
SHEET 1 880 680
WIRE 192 160 128 160
WIRE 448 160 192 160
WIRE 624 160 512 160
WIRE 192 192 192 160
WIRE 272 192 192 192
WIRE 448 192 336 192
WIRE 272 224 272 208
WIRE 464 224 464 208
FLAG 128 160 in
IOPIN 128 160 In
FLAG 464 224 0
FLAG 624 160 out
IOPIN 624 160 Out
FLAG 272 224 0
SYMBOL Digital\\and 480 112 R0
WINDOW 0 -36 12 Left 2
SYMATTR InstName A2
SYMBOL Digital\\inv 272 128 R0
WINDOW 3 21 88 Left 2
WINDOW 0 -38 78 Left 2
SYMATTR Value TD={td}
SYMATTR InstName A1
TEXT 88 64 Left 2 !.param td=10n
TEXT 80 16 Left 4 ;Positive Edge Detector
TEXT 88 136 Left 1 ;binary
TEXT 624 136 Left 1 ;binary
TEXT 544 104 Left 1 ;td
TEXT 304 64 Left 2 ;pulse width
TEXT 584 56 Left 2 ;2024-12-29
LINE Normal 544 144 528 144
LINE Normal 544 144 544 112
LINE Normal 560 144 560 112
LINE Normal 576 144 560 144
LINE Normal 544 112 560 112

sub.asc, the sub-circuit schematic file:
Version 4
SHEET 1 880 680
WIRE 288 96 208 96
WIRE 208 112 208 96
WIRE 96 128 48 128
WIRE 96 176 48 176
WIRE 208 208 208 192
FLAG 48 128 IN1
IOPIN 48 128 In
FLAG 48 176 IN2
IOPIN 48 176 In
FLAG 208 208 0
FLAG 288 96 OUT
IOPIN 288 96 Out
SYMBOL bv 208 96 R0
SYMATTR InstName B1
SYMATTR Value V=V(IN1)-V(IN2)
TEXT -16 40 Left 2 ;SUBTRACT
TEXT 224 48 Left 2 ;2024-12-29

mux.asc, the sub-circuit schematic file:
Version 4
SHEET 1 880 680
WIRE 336 16 208 16
WIRE 128 32 96 32
WIRE 208 48 208 16
WIRE 128 80 96 80
WIRE 128 144 96 144
WIRE 208 160 208 128
FLAG 96 32 in1
IOPIN 96 32 In
FLAG 96 80 in2
IOPIN 96 80 In
FLAG 96 144 sel
IOPIN 96 144 In
FLAG 336 16 out
IOPIN 336 16 Out
FLAG 208 160 0
SYMBOL bv 208 32 R0
SYMATTR InstName B1
SYMATTR Value V=IF(V(sel)>0.5,V(in1),V(in2))
TEXT 24 -40 Left 2 ;2-1 Multiplexer
TEXT 40 120 Left 1 ;binary
TEXT 40 168 Left 1 ;1: out=in1\n0: out=in2

The netlist it stands for:
* TLVR_4phBUCK_powerstage.asc
V1 in 0 {Vin}
C1 out 0 47µ m=2 Rser=0.1m
X§X2 N004 N001 sw1 iGD  ; pins in g s
X§X3 N007 N008 0 iGD  ; pins in g s
X§X1 pwm1 N007 N004 deadtime params: dt=10n
X§X10 in N001 sw1 iNMOS params: esl=1f rsnb=1k csnb=10p ron=0.1m  ; pins D G S
X§X6 N012 N011 sw2 iGD  ; pins in g s
X§X7 N015 N017 0 iGD  ; pins in g s
X§X8 pwm2 N015 N012 deadtime params: dt=10n
X§X30 N021 N020 sw3 iGD  ; pins in g s
X§X31 N024 N025 0 iGD  ; pins in g s
X§X32 pwm3 N024 N021 deadtime params: dt=10n
X§X40 N034 N033 sw4 iGD  ; pins in g s
X§X41 N037 N038 0 iGD  ; pins in g s
X§X42 pwm4 N037 N034 deadtime params: dt=10n
Lp1 sw1 out {Lp} Rser=0.125m
Ls1 N006 0 {Ls} Rser=0.45m
Lp2 sw2 out {Lp} Rser=0.125m
Ls2 N014 N006 {Ls} Rser=0.45m
Lp3 sw3 out {Lp} Rser=0.125m
Ls3 N023 N014 {Ls} Rser=0.45m
Lp4 sw4 out {Lp} Rser=0.125m
Ls4 N036 N023 {Ls} Rser=0.45m
Lc 0 N036 {Lc} Rser=2m
C2 out 0 47µ m=2 Rser=0.1m
C3 out 0 47µ m=2 Rser=0.1m
C4 out 0 47µ m=2 Rser=0.1m
X§X57 N026 CONST K={Vout}  ; pins K
X§X63 N026 N029 ref min
X§X64 N032 N029 slope params: se={Vout/0.2m}
X§X65 N032 timer params: T=1n
X§X12 ton req1 pwm1 oneshot
X§X13 out ref req cmp params: hys=1m
A12 0 rdy1 0 req 0 0 req1 0 AND
X§X9 pwm1 N005 rdy1 NC_01 srff params: prio=0
X§X11 wake1 N005 posedge params: td=10n
X§X14 toffset req1 N009 oneshot
X§X16 ton req2 pwm2 oneshot
A1 0 rdy2 0 req 0 0 req2 0 AND
X§X17 pwm2 N010 rdy2 NC_02 srff params: prio=0
X§X19 wake2 N010 posedge params: td=10n
X§X20 toffset req2 N013 oneshot
X§X21 ton req3 pwm3 oneshot
A2 0 rdy3 0 req 0 0 req3 0 AND
X§X22 pwm3 N016 rdy3 NC_03 srff params: prio=0
X§X24 wake3 N016 posedge params: td=10n
X§X25 toffset req3 N018 oneshot
X§X26 N035 CONST K={Tos_hi}  ; pins K
X§X27 ton req4 pwm4 oneshot
A3 0 rdy4 0 req 0 0 req4 0 AND
X§X34 pwm4 N019 rdy4 NC_04 srff params: prio=0
X§X35 wake4 N019 posedge params: td=10n
X§X36 toffset req4 N022 oneshot
A4 N009 0 0 0 0 wake2 0 0 BUF
A5 N013 0 0 0 0 wake3 0 0 BUF
A6 N018 0 0 0 0 wake4 0 0 BUF
A7 N022 0 0 0 0 wake1 0 0 BUF
X§X37 N002 N003 posedge params: td=10n
A8 0 N003 0 0 0 0 N005 0 OR
X§X44 N002 timer params: T=1n
X§X5 ton CONST K={Ton}  ; pins K
X§X15 sw1 N008 0 iNMOS params: esl=1f rsnb=1k csnb=10p ron=0.1m  ; pins D G S
X§X18 in N011 sw2 iNMOS params: esl=1f rsnb=1k csnb=10p ron=0.1m  ; pins D G S
X§X28 sw2 N017 0 iNMOS params: esl=1f rsnb=1k csnb=10p ron=0.1m  ; pins D G S
X§X29 in N020 sw3 iNMOS params: esl=1f rsnb=1k csnb=10p ron=0.1m  ; pins D G S
X§X38 sw3 N025 0 iNMOS params: esl=1f rsnb=1k csnb=10p ron=0.1m  ; pins D G S
X§X39 in N033 sw4 iNMOS params: esl=1f rsnb=1k csnb=10p ron=0.1m  ; pins D G S
X§X45 sw4 N038 0 iNMOS params: esl=1f rsnb=1k csnb=10p ron=0.1m  ; pins D G S
X§X46 out N028 N027 cmp params: hys=1m
X§X47 ref N031 N028 sub
X§X48 N031 CONST K=5m  ; pins K
X§X49 N030 N035 N027 toffset mux
X§X50 N030 CONST K={Tos_lo}  ; pins K
Iload out 0 PWL(0 {ilo} 0.3m {ilo} +{trtf} {ihi} 0.6m {ihi} +{trtf} {ilo})
C5 out 0 470µ m=6 Rser=2m

* block symbol definitions
.subckt deadtime in l h
A1 in 0 0 0 0 0 N002 0 BUF
A2 in 0 0 0 0 0 N001 0 BUF TD={dt}
A3 0 N001 0 N002 0 0 h 0 AND
A4 0 N001 0 N002 0 l 0 0 OR
.param dt=10n
* Deadtime Generator
* deadtime(sec)
* hi-side
* lo-side
* in
* h
* l
* dt
* dt
* 2024-12-29
.ends deadtime

.subckt min in1 in2 out
B1 out 0 V=IF(V(in1)<V(in2),V(in1),V(in2))
R1 in1 0 1Meg
R2 in2 0 1Meg
* Minimum Input Select
.ends min

.subckt slope in out
I1 0 a {ibias}
C3 a 0 {cacc}
B1 out 0 V=IF(V(in)>0.5, se*(V(a)-V(b)), 0)
R1 o 0 1k
B2 b 0 V=V(o)
B3 N001 0 V=IF(V(in)>0.5,1, 0)
R2 N001 0 1k
.param se=1
* Slope
* binary
* dv/dt of the slope(V/sec)
* in
* out
* dv/dt=se
* 2026-03-18
* <Revision History>
* 2024-12-29: Initial Versoin
* 2025-02-23: Made following edit to remove negative spike at slope reset and improve simulation time.
*                     - scale of I1 & C2 by 1/1000, and reduced resistance of diode Ron and buffer Rout
*                     - changed C1 snubber parameter,
*                     - added D2 to clamp negative voltage at node a
*                     - added new parameter vsat to be able to specify saturating voltage
* 2025-04-12: Bug fix
*                     - Fixed a bug where the model would not work when vsat was set to a high voltage
*                     - Changed default vsat to 1000V (originally 1V).
* 2025-05-31: Solved convergence issue at high "se"
*                     - Replaced current source with state machine.
* 2026-01-02: Changed to .machine base for higher accuracy and convergence.
*                     - removed .param vsat
* 2026-03-18: Updated .machine statement syntax to support older version of the LTspice.
* .param vsat=1000 (removed)
.param cacc=1u
.param ibias=1u
.ic V(a)=0
.machine
.state LO 0
.state HI 1
.rule LO HI V(in)>.5
.rule HI LO V(in)<.5
.output (o) IF((state==1),V(b), V(a))
.endmachine
* dummy circuit to ensure stiff falling edge
.ends slope

.subckt timer out
B1 out 0 V=IF(time>=T,1,0)
.param T=1m
* Timer
* binary
* t=0
* t=T
* 2024-12-29
.ends timer

.subckt oneshot ton trg out
I1 0 a {ibias}
C1 a 0 {cacc}
X§X2 a N003 N002 sum
X§X4 ton N003 gain params: G={ibias/cacc}
X§X5 trg N002 N001 samplehold
X§X6 a N001 out cmp params: hys=0
* One Shot Pulse Generator
.param cacc=1u
.param ibias=1u
.ic V(a)=0
* 2025-12-29
.ends oneshot

.subckt sum in1 in2 out
B1 OUT 0 V=V(IN1)+V(IN2)
* SUM
* 2024-12-29
.ends sum

.subckt gain in out
B1 out 0 V={G}*V(in)
.param G=1
* GAIN
* 2024-12-29
.ends gain

.subckt samplehold CLK IN OUT
R1 o 0 1k
B1 OUT 0 V=V(o)
* Sample & Hold
* binary
* 2025-3-23
.machine
.state LO 0
.state LATCH 1
.state HI 2
.rule LO LATCH V(clk)>.5
.rule LATCH HI  V(clk)>.9
.rule * LO V(clk)<.5
.output (o) IF((state==1),V(in),V(out))
.endmachine
.ends samplehold

.subckt cmp inn inp out
R1 a 0 1k
A1 a 0 0 0 0 0 out 0 BUF
.machine
.state LO 0
.state HI 1
.rule LO HI V(inp)>(V(inn)+{hys})
.rule HI LO V(inp)<(V(inn)-{hys})
.output (a) state
.endmachine
.param hys=0
* Comparator
* hysteresis voltage
* 2024-12-29
.ends cmp

.subckt srff R S Q xQ
A1 R 0 0 0 0 N001 0 0 BUF
A2 0 S 0 N001 0 0 Sa 0 AND
A3 Qa 0 0 0 0 xQ 0 0 BUF
A4 Qa 0 0 0 0 0 Q 0 BUF
R1 Qa 0 1k
B1 Reff 0 V=IF({prio}==0,V(R),V(R_))
A5 S 0 0 0 0 N002 0 0 BUF
A6 0 N002 0 R 0 0 R_ 0 AND
.machine
.state LO 0
.state HI1 1
.state HI2 1
.rule LO HI1 V(Sa)>0.5
.rule HI1 HI2 V(Sa)<0.5
.rule HI2 LO V(Reff)>0.5
.output (Qa) state
.endmachine
* SR Flip-Flop
* binary
* binary
* binary
* binary
* 2025-12-29
.param prio=0
* 0: priority on R (default), 1: priority on S
* <Revision History>
* 2024-12-29: Initial version
* 2025-12-29: Added parameter "prio" to specify priority between R and S. No impact on default behaviour.
.ends srff

.subckt posedge in out
A2 0 in 0 N001 0 0 out 0 AND
A1 in 0 0 0 0 N001 0 0 BUF TD={td}
.param td=10n
* Positive Edge Detector
* binary
* binary
* td
* pulse width
* 2024-12-29
.ends posedge

.subckt sub in1 in2 out
B1 OUT 0 V=V(IN1)-V(IN2)
* SUBTRACT
* 2024-12-29
.ends sub

.subckt mux in1 in2 sel out
B1 out 0 V=IF(V(sel)>0.5,V(in1),V(in2))
* 2-1 Multiplexer
* binary
* 1: out=in1
* 0: out=in2
.ends mux

.tran 0 0.306m 0.296m
* TLVR Four-Phase Buck (Power Stage Model) with Fixed Ton
* 2026-01-03
.param Vin=12
.param Vout=0.5
.param Lp=70n
.param Ls=60n
.param Kps=0.94
.param Lc=0.12n
.param fsw=1Meg
.param ilo=200
.param ihi=400
.param trtf=1u
.options solver="norm"
.options method="gear"
Kps1 Lp1 Ls1 {Kps}
Kps2 Lp2 Ls2 {Kps}
Kps3 Lp3 Ls3 {Kps}
Kps4 Lp4 Ls4 {Kps}
* softstart
.param Ton=50n
.param Tos_lo=100n
.param Tos_hi=200n
.backanno
.end